# Altium project PSLink.PrjPcb (part 1 of 3)
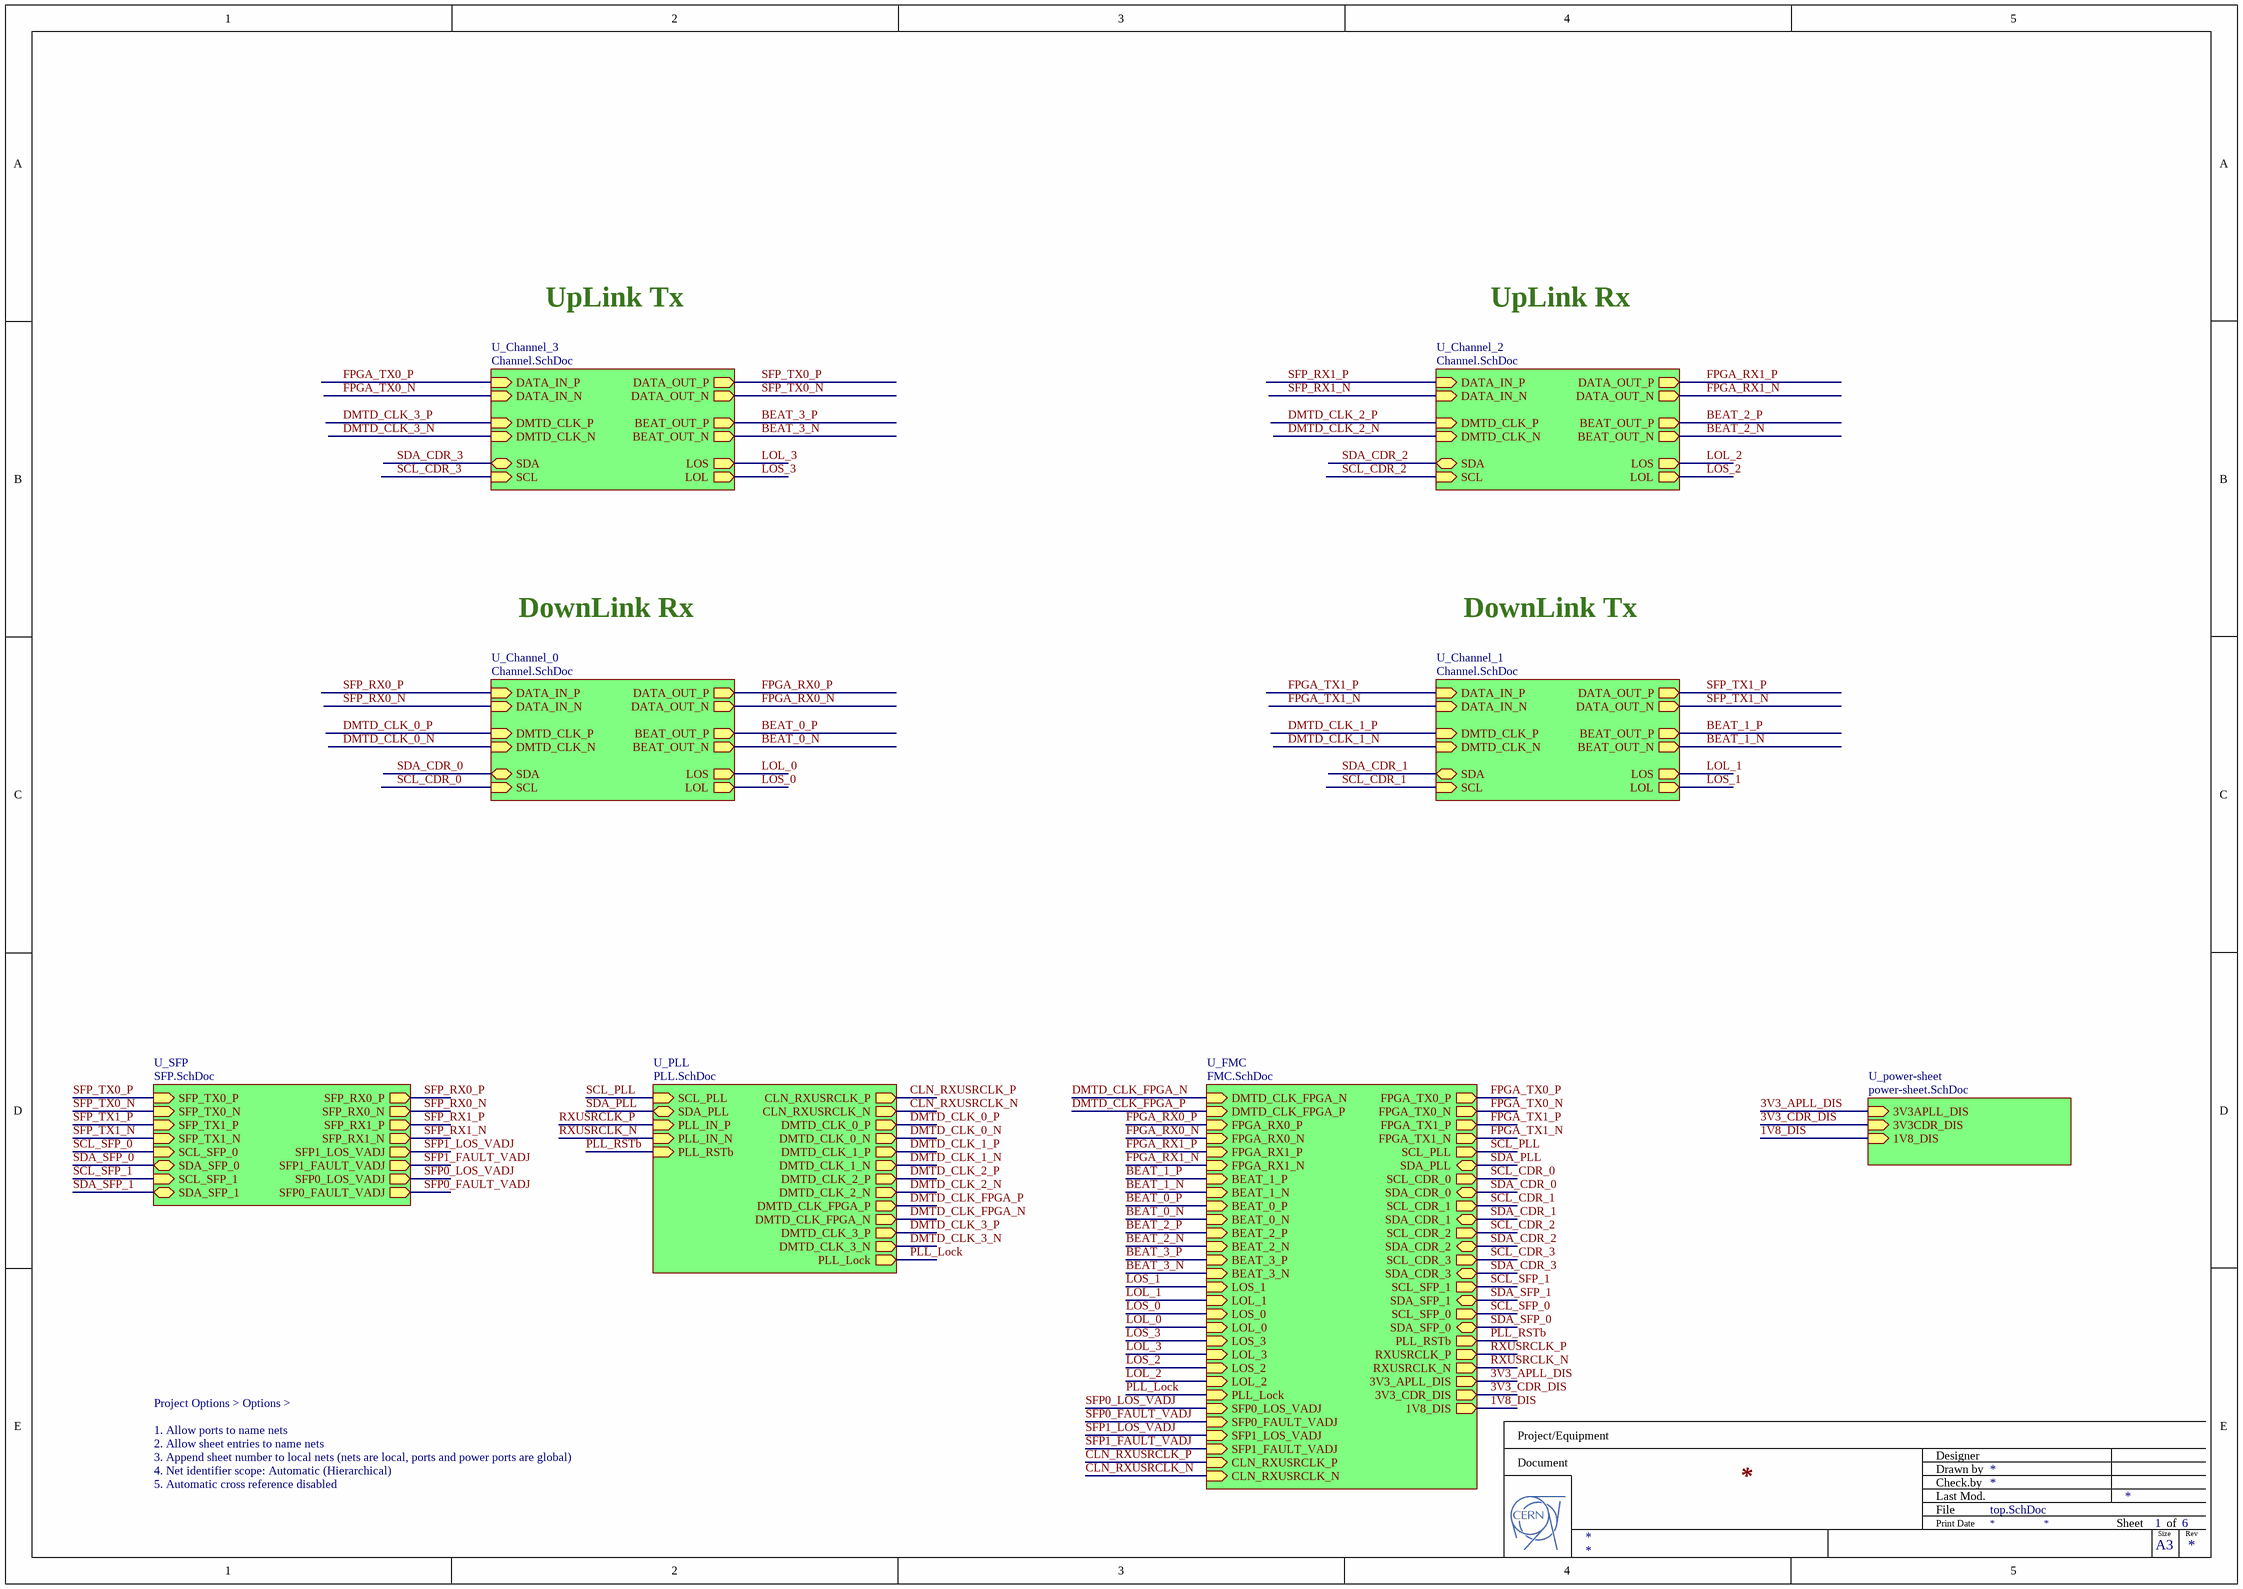
[diagram p0: top.SchDoc]
Board_Revision: 1.0
6 sheets, 435 parts. Net scope: hierarchical (ports join the sheet entries above them; power ports are global).
Board files: PCB.PcbDoc, relaxed_transition.PcbDoc
Sheets:
  top.SchDoc
    U_SFP = SFP.SchDoc
    U_PLL = PLL.SchDoc
    U_Channel_3 = Channel.SchDoc
    U_Channel_2 = Channel.SchDoc
    U_Channel_1 = Channel.SchDoc
    U_Channel_0 = Channel.SchDoc
    U_power-sheet = power-sheet.SchDoc
    U_FMC = FMC.SchDoc

## Sheet top.SchDoc
size 420 x 297 mm; SheetNumber: 1; SheetTotal: 6

### Sub-sheets
U_Channel_0 = Channel.SchDoc: DATA_IN_P (in), DATA_IN_N (in), BEAT_OUT_P (out), BEAT_OUT_N (out), DMTD_CLK_P (in), DMTD_CLK_N (in), DATA_OUT_P (out), DATA_OUT_N (out), LOS (out), LOL (out), SDA (bidir), SCL (in)
U_Channel_1 = Channel.SchDoc: DATA_IN_P (in), DATA_IN_N (in), BEAT_OUT_P (out), BEAT_OUT_N (out), DMTD_CLK_P (in), DMTD_CLK_N (in), DATA_OUT_P (out), DATA_OUT_N (out), LOS (out), LOL (out), SDA (bidir), SCL (in)
U_Channel_2 = Channel.SchDoc: DATA_IN_P (in), DATA_IN_N (in), BEAT_OUT_P (out), BEAT_OUT_N (out), DMTD_CLK_P (in), DMTD_CLK_N (in), DATA_OUT_P (out), DATA_OUT_N (out), LOS (out), LOL (out), SDA (bidir), SCL (in)
U_Channel_3 = Channel.SchDoc: DATA_IN_P (in), DATA_IN_N (in), BEAT_OUT_P (out), BEAT_OUT_N (out), DMTD_CLK_P (in), DMTD_CLK_N (in), DATA_OUT_P (out), DATA_OUT_N (out), LOS (out), LOL (out), SDA (bidir), SCL (in)
U_FMC = FMC.SchDoc: DMTD_CLK_FPGA_N (in), DMTD_CLK_FPGA_P (in), FPGA_RX0_P (in), FPGA_RX0_N (in), FPGA_TX0_P (out), FPGA_TX0_N (out), FPGA_RX1_P (in), FPGA_RX1_N (in), FPGA_TX1_P (out), FPGA_TX1_N (out), BEAT_1_P (in), BEAT_1_N (in), BEAT_0_P (in), BEAT_0_N (in), BEAT_2_P (in), BEAT_2_N (in), BEAT_3_P (in), BEAT_3_N (in), SCL_PLL (out), SDA_PLL (bidir), SCL_CDR_0 (out), SDA_CDR_0 (bidir), SCL_CDR_1 (out), SDA_CDR_1 (bidir), SCL_CDR_2 (out), SDA_CDR_2 (bidir), SCL_CDR_3 (out), SDA_CDR_3 (bidir), SCL_SFP_1 (out), SDA_SFP_1 (bidir), SCL_SFP_0 (out), SDA_SFP_0 (bidir), LOS_1 (in), LOL_1 (in), LOS_0 (in), LOL_0 (in), LOS_3 (in), LOL_3 (in), LOS_2 (in), LOL_2 (in), PLL_Lock (in), SFP0_LOS_VADJ (in), SFP0_FAULT_VADJ (in), SFP1_LOS_VADJ (in), SFP1_FAULT_VADJ (in), PLL_RSTb (out), CLN_RXUSRCLK_P (in), CLN_RXUSRCLK_N (in), RXUSRCLK_P (out), RXUSRCLK_N (out), 3V3_APLL_DIS (out), 3V3_CDR_DIS (out), 1V8_DIS (out)
U_PLL = PLL.SchDoc: SCL_PLL (in), SDA_PLL (bidir), PLL_IN_P (in), PLL_IN_N (in), CLN_RXUSRCLK_P (out), CLN_RXUSRCLK_N (out), DMTD_CLK_0_P (out), DMTD_CLK_0_N (out), DMTD_CLK_1_P (out), DMTD_CLK_1_N (out), DMTD_CLK_2_P (out), DMTD_CLK_2_N (out), DMTD_CLK_FPGA_P (out), DMTD_CLK_FPGA_N (out), DMTD_CLK_3_P (out), DMTD_CLK_3_N (out), PLL_Lock (out), PLL_RSTb (in)
U_power-sheet = power-sheet.SchDoc: 3V3APLL_DIS (in), 3V3CDR_DIS (in), 1V8_DIS (in)
U_SFP = SFP.SchDoc: SFP_RX0_P (out), SFP_RX0_N (out), SFP_TX0_P (in), SFP_TX0_N (in), SFP_RX1_P (out), SFP_RX1_N (out), SFP_TX1_P (in), SFP_TX1_N (in), SCL_SFP_0 (in), SDA_SFP_0 (bidir), SCL_SFP_1 (in), SDA_SFP_1 (bidir), SFP1_LOS_VADJ (out), SFP1_FAULT_VADJ (out), SFP0_LOS_VADJ (out), SFP0_FAULT_VADJ (out)

### Nets
1V8_DIS: sheet U_power-sheet/1V8_DIS, sheet U_FMC/1V8_DIS
3V3_APLL_DIS: sheet U_power-sheet/3V3APLL_DIS, sheet U_FMC/3V3_APLL_DIS
3V3_CDR_DIS: sheet U_power-sheet/3V3CDR_DIS, sheet U_FMC/3V3_CDR_DIS
BEAT_0_N: sheet U_Channel_0/BEAT_OUT_N, sheet U_FMC/BEAT_0_N
BEAT_0_P: sheet U_Channel_0/BEAT_OUT_P, sheet U_FMC/BEAT_0_P
BEAT_1_N: sheet U_Channel_1/BEAT_OUT_N, sheet U_FMC/BEAT_1_N
BEAT_1_P: sheet U_Channel_1/BEAT_OUT_P, sheet U_FMC/BEAT_1_P
BEAT_2_N: sheet U_Channel_2/BEAT_OUT_N, sheet U_FMC/BEAT_2_N
BEAT_2_P: sheet U_Channel_2/BEAT_OUT_P, sheet U_FMC/BEAT_2_P
BEAT_3_N: sheet U_Channel_3/BEAT_OUT_N, sheet U_FMC/BEAT_3_N
BEAT_3_P: sheet U_Channel_3/BEAT_OUT_P, sheet U_FMC/BEAT_3_P
CLN_RXUSRCLK_N: sheet U_PLL/CLN_RXUSRCLK_N, sheet U_FMC/CLN_RXUSRCLK_N
CLN_RXUSRCLK_P: sheet U_PLL/CLN_RXUSRCLK_P, sheet U_FMC/CLN_RXUSRCLK_P
DMTD_CLK_0_N: sheet U_PLL/DMTD_CLK_0_N, sheet U_Channel_0/DMTD_CLK_N
DMTD_CLK_0_P: sheet U_PLL/DMTD_CLK_0_P, sheet U_Channel_0/DMTD_CLK_P
DMTD_CLK_1_N: sheet U_PLL/DMTD_CLK_1_N, sheet U_Channel_1/DMTD_CLK_N
DMTD_CLK_1_P: sheet U_PLL/DMTD_CLK_1_P, sheet U_Channel_1/DMTD_CLK_P
DMTD_CLK_2_N: sheet U_PLL/DMTD_CLK_2_N, sheet U_Channel_2/DMTD_CLK_N
DMTD_CLK_2_P: sheet U_PLL/DMTD_CLK_2_P, sheet U_Channel_2/DMTD_CLK_P
DMTD_CLK_3_N: sheet U_PLL/DMTD_CLK_3_N, sheet U_Channel_3/DMTD_CLK_N
DMTD_CLK_3_P: sheet U_PLL/DMTD_CLK_3_P, sheet U_Channel_3/DMTD_CLK_P
DMTD_CLK_FPGA_N: sheet U_PLL/DMTD_CLK_FPGA_N, sheet U_FMC/DMTD_CLK_FPGA_N
DMTD_CLK_FPGA_P: sheet U_PLL/DMTD_CLK_FPGA_P, sheet U_FMC/DMTD_CLK_FPGA_P
FPGA_RX0_N: sheet U_Channel_0/DATA_OUT_N, sheet U_FMC/FPGA_RX0_N
FPGA_RX0_P: sheet U_Channel_0/DATA_OUT_P, sheet U_FMC/FPGA_RX0_P
FPGA_RX1_N: sheet U_Channel_2/DATA_OUT_N, sheet U_FMC/FPGA_RX1_N
FPGA_RX1_P: sheet U_Channel_2/DATA_OUT_P, sheet U_FMC/FPGA_RX1_P
FPGA_TX0_N: sheet U_Channel_3/DATA_IN_N, sheet U_FMC/FPGA_TX0_N
FPGA_TX0_P: sheet U_Channel_3/DATA_IN_P, sheet U_FMC/FPGA_TX0_P
FPGA_TX1_N: sheet U_Channel_1/DATA_IN_N, sheet U_FMC/FPGA_TX1_N
FPGA_TX1_P: sheet U_Channel_1/DATA_IN_P, sheet U_FMC/FPGA_TX1_P
LOL_0: sheet U_Channel_0/LOS, sheet U_FMC/LOL_0
LOL_1: sheet U_Channel_1/LOS, sheet U_FMC/LOL_1
LOL_2: sheet U_Channel_2/LOS, sheet U_FMC/LOL_2
LOL_3: sheet U_Channel_3/LOS, sheet U_FMC/LOL_3
LOS_0: sheet U_Channel_0/LOL, sheet U_FMC/LOS_0  [project net LOL]
LOS_1: sheet U_Channel_1/LOL, sheet U_FMC/LOS_1  [project net LOL]
LOS_2: sheet U_Channel_2/LOL, sheet U_FMC/LOS_2  [project net LOL]
LOS_3: sheet U_Channel_3/LOL, sheet U_FMC/LOS_3  [project net LOL]
PLL_Lock: sheet U_PLL/PLL_Lock, sheet U_FMC/PLL_Lock  [project net Lock]
PLL_RSTb: sheet U_PLL/PLL_RSTb, sheet U_FMC/PLL_RSTb
RXUSRCLK_N: sheet U_PLL/PLL_IN_N, sheet U_FMC/RXUSRCLK_N
RXUSRCLK_P: sheet U_PLL/PLL_IN_P, sheet U_FMC/RXUSRCLK_P
SCL_CDR_0: sheet U_Channel_0/SCL, sheet U_FMC/SCL_CDR_0  [project net SCL_5]
SCL_CDR_1: sheet U_Channel_1/SCL, sheet U_FMC/SCL_CDR_1  [project net SCL_4]
SCL_CDR_2: sheet U_Channel_2/SCL, sheet U_FMC/SCL_CDR_2  [project net SCL_3]
SCL_CDR_3: sheet U_Channel_3/SCL, sheet U_FMC/SCL_CDR_3  [project net SCL_2]
SCL_PLL: sheet U_PLL/SCL_PLL, sheet U_FMC/SCL_PLL  [project net ADJ_SCL]
SCL_SFP_0: sheet U_SFP/SCL_SFP_0, sheet U_FMC/SCL_SFP_0  [project net SCL0]
SCL_SFP_1: sheet U_SFP/SCL_SFP_1, sheet U_FMC/SCL_SFP_1  [project net SCL1]
SDA_CDR_0: sheet U_Channel_0/SDA, sheet U_FMC/SDA_CDR_0  [project net SDA_5]
SDA_CDR_1: sheet U_Channel_1/SDA, sheet U_FMC/SDA_CDR_1  [project net SDA_4]
SDA_CDR_2: sheet U_Channel_2/SDA, sheet U_FMC/SDA_CDR_2  [project net SDA_3]
SDA_CDR_3: sheet U_Channel_3/SDA, sheet U_FMC/SDA_CDR_3  [project net SDA_2]
SDA_PLL: sheet U_PLL/SDA_PLL, sheet U_FMC/SDA_PLL  [project net ADJ_SDA]
SDA_SFP_0: sheet U_SFP/SDA_SFP_0, sheet U_FMC/SDA_SFP_0  [project net SDA0]
SDA_SFP_1: sheet U_SFP/SDA_SFP_1, sheet U_FMC/SDA_SFP_1  [project net SDA1]
SFP0_FAULT_VADJ: sheet U_SFP/SFP0_FAULT_VADJ, sheet U_FMC/SFP0_FAULT_VADJ
SFP0_LOS_VADJ: sheet U_SFP/SFP0_LOS_VADJ, sheet U_FMC/SFP0_LOS_VADJ
SFP1_FAULT_VADJ: sheet U_SFP/SFP1_FAULT_VADJ, sheet U_FMC/SFP1_FAULT_VADJ
SFP1_LOS_VADJ: sheet U_SFP/SFP1_LOS_VADJ, sheet U_FMC/SFP1_LOS_VADJ
SFP_RX0_N: sheet U_SFP/SFP_RX0_N, sheet U_Channel_0/DATA_IN_N
SFP_RX0_P: sheet U_SFP/SFP_RX0_P, sheet U_Channel_0/DATA_IN_P
SFP_RX1_N: sheet U_SFP/SFP_RX1_N, sheet U_Channel_2/DATA_IN_N
SFP_RX1_P: sheet U_SFP/SFP_RX1_P, sheet U_Channel_2/DATA_IN_P
SFP_TX0_N: sheet U_SFP/SFP_TX0_N, sheet U_Channel_3/DATA_OUT_N
SFP_TX0_P: sheet U_SFP/SFP_TX0_P, sheet U_Channel_3/DATA_OUT_P
SFP_TX1_N: sheet U_SFP/SFP_TX1_N, sheet U_Channel_1/DATA_OUT_N
SFP_TX1_P: sheet U_SFP/SFP_TX1_P, sheet U_Channel_1/DATA_OUT_P

### Notes on the sheet
- UpLink Tx
- UpLink Rx
- DownLink Rx
- DownLink Tx
- Project Options > Options >
  1. Allow ports to name nets
  2. Allow sheet entries to name nets
  3. Append sheet number to local nets (nets are local, ports and power ports are global)
  4. Net identifier scope: Automatic (Hierarchical)
  5. Automatic cross reference disabled
- Project/Equipment
- Document
- Designer
- Drawn by
- Check.by
- File
- Last Mod.
- Print Date
- Sheet
- Size
- A3
- of
- Rev

## Sheet SFP.SchDoc
size 420 x 297 mm; SheetNumber: 2; SheetTotal: 6
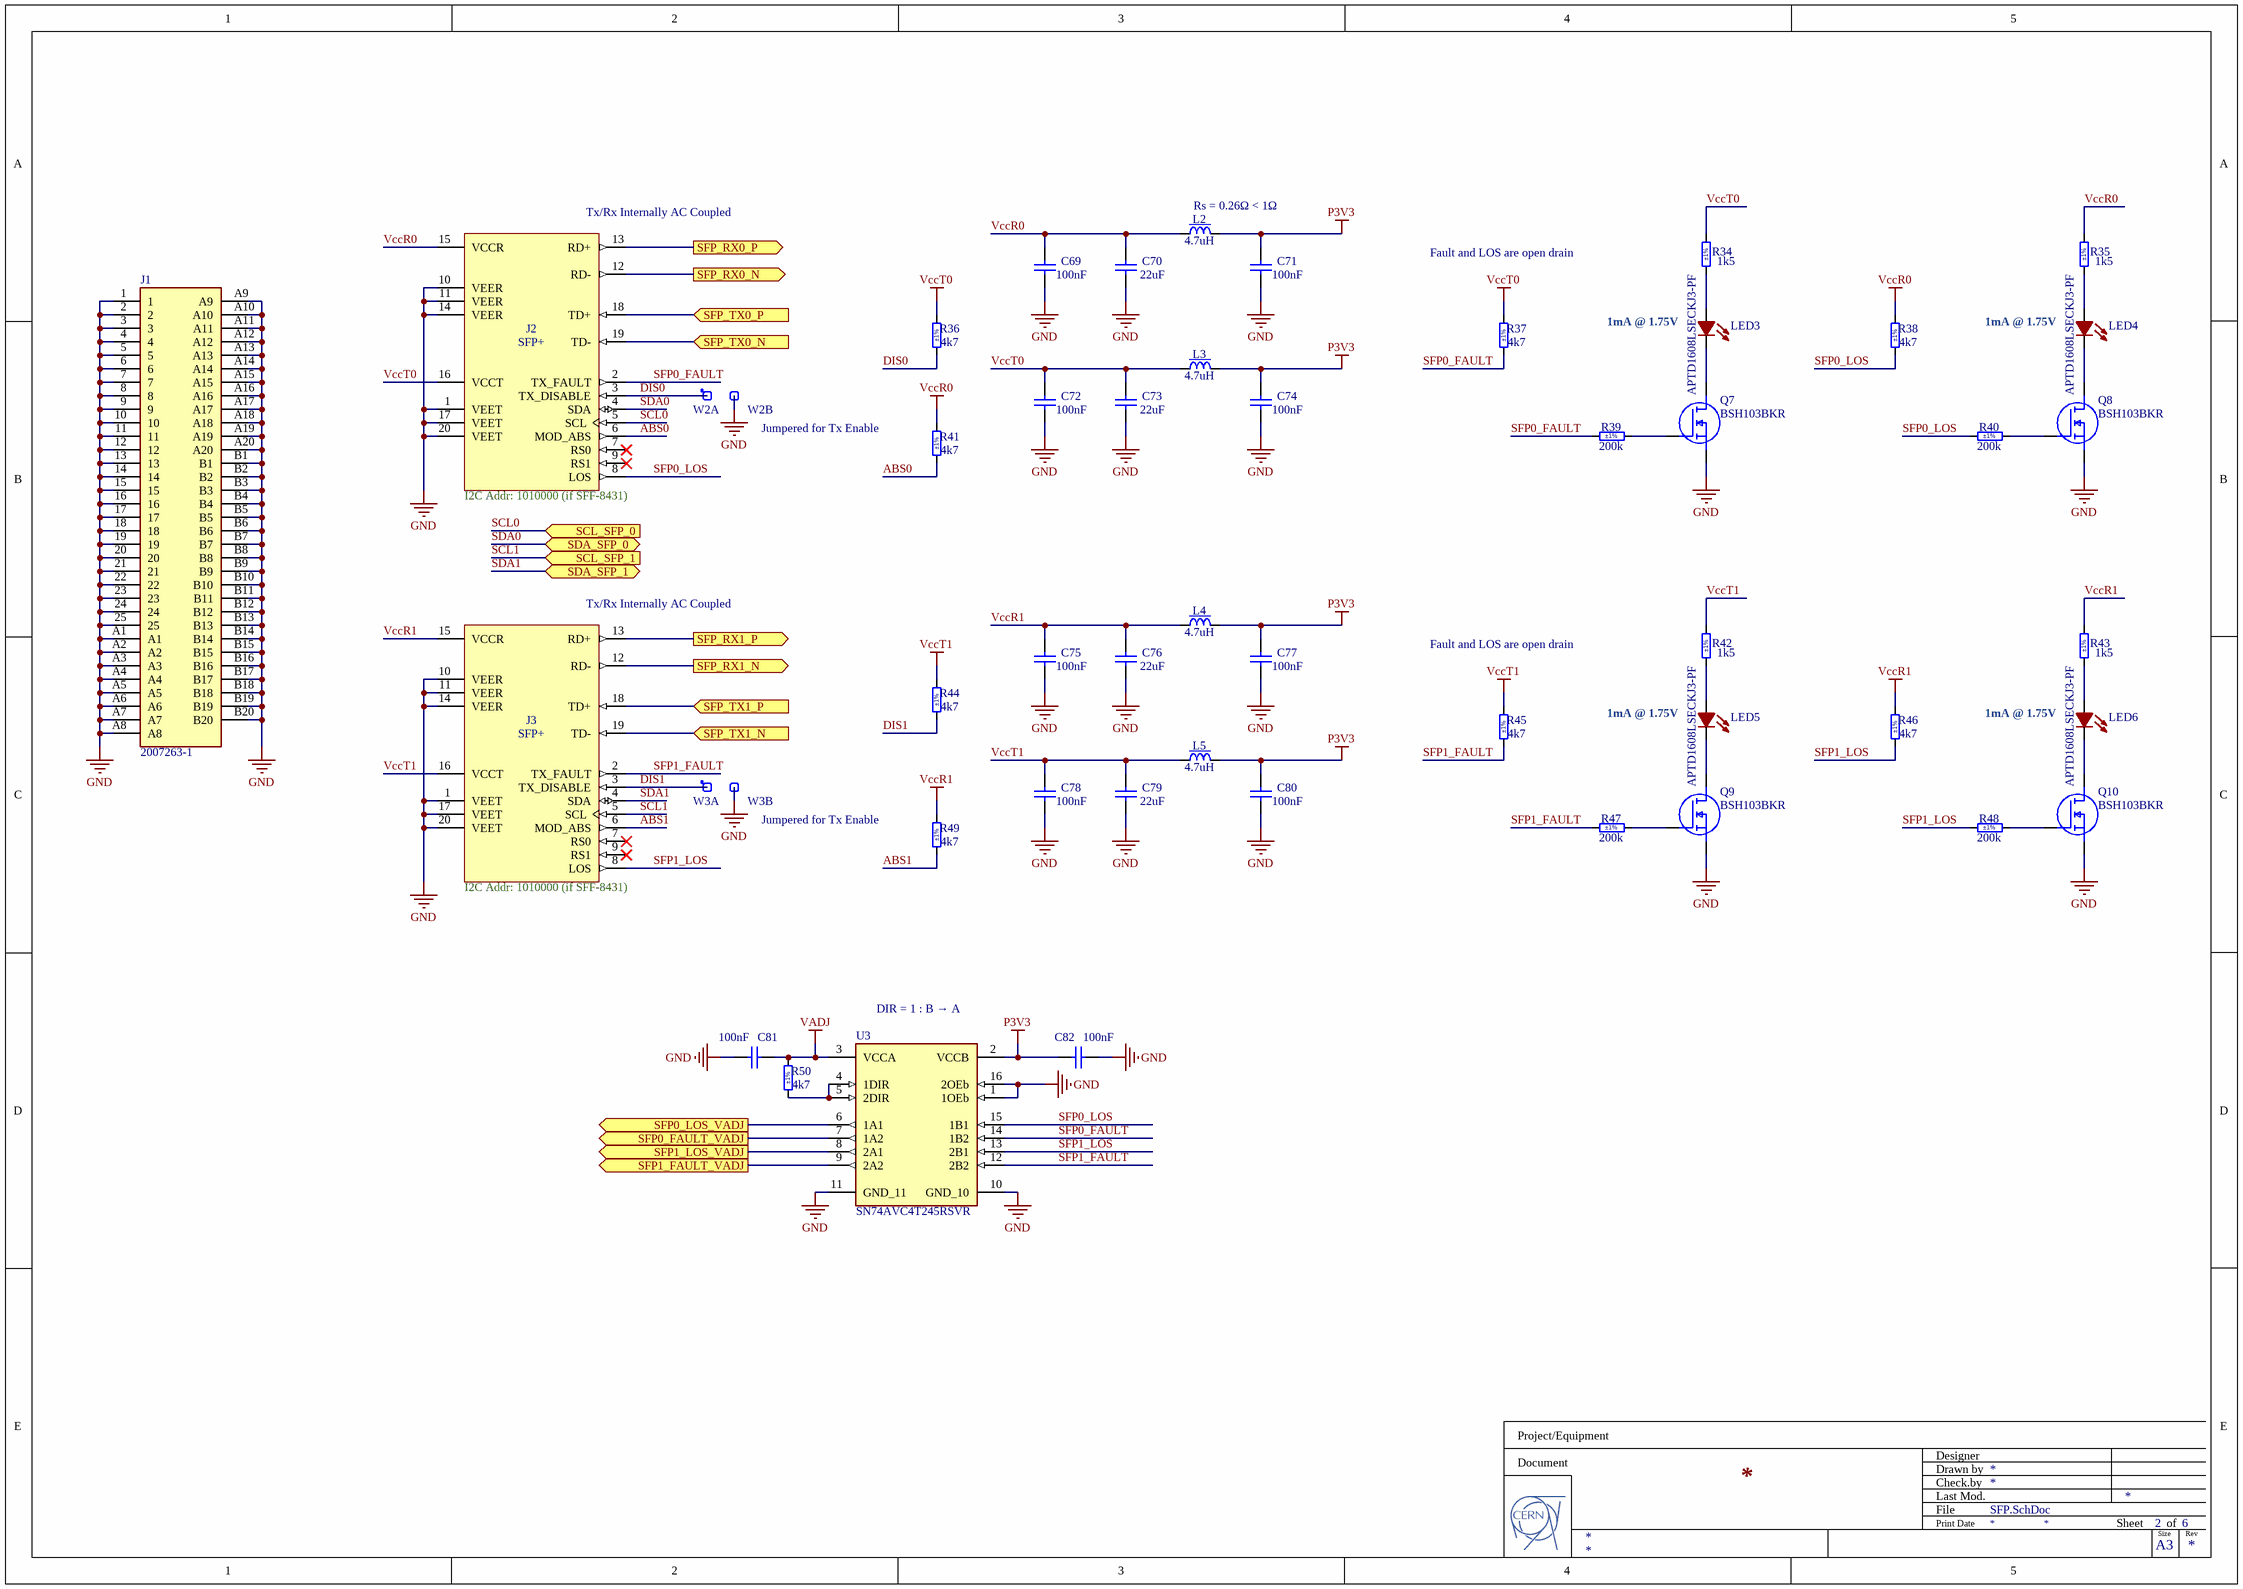
[diagram p1: SFP.SchDoc]

### Parts
C69  100nF  [CAPC0603X33N]
C70  22uF  [CAPC1005X70N]
C71  100nF  [CAPC0603X33N]
C72  100nF  [CAPC0603X33N]
C73  22uF  [CAPC1005X70N]
C74  100nF  [CAPC0603X33N]
C75  100nF  [CAPC0603X33N]
C76  22uF  [CAPC1005X70N]
C77  100nF  [CAPC0603X33N]
C78  100nF  [CAPC0603X33N]
C79  22uF  [CAPC1005X70N]
C80  100nF  [CAPC0603X33N]
C81  100nF  [CAPC0603X33N]
C82  100nF  [CAPC0603X33N]
J1  2007263-1  [20072631]
J2  SFP+  [TYCO_1888247-1]
J3  SFP+  [TYCO_1888247-1]
L2  4.7uH  [IND_MURATA_LQH32C]
L3  4.7uH  [IND_MURATA_LQH32C]
L4  4.7uH  [IND_MURATA_LQH32C]
L5  4.7uH  [IND_MURATA_LQH32C]
LED3  APTD1608LSECKJ3-PF  [LED_APTD1608LSECKJ3-PF_KNB]
LED4  APTD1608LSECKJ3-PF  [LED_APTD1608LSECKJ3-PF_KNB]
LED5  APTD1608LSECKJ3-PF  [LED_APTD1608LSECKJ3-PF_KNB]
LED6  APTD1608LSECKJ3-PF  [LED_APTD1608LSECKJ3-PF_KNB]
Q7  BSH103BKR  [SOT95P230X110-3N]
Q8  BSH103BKR  [SOT95P230X110-3N]
Q9  BSH103BKR  [SOT95P230X110-3N]
Q10  BSH103BKR  [SOT95P230X110-3N]
R34  1k5  Tolerance: ±1%  [RESC1005X40N]
R35  1k5  Tolerance: ±1%  [RESC1005X40N]
R36  4k7  Tolerance: ±1%  [RESC1005X40N]
R37  4k7  Tolerance: ±1%  [RESC1005X40N]
R38  4k7  Tolerance: ±1%  [RESC1005X40N]
R39  200k  Tolerance: ±1%  [RESC1005X40N]
R40  200k  Tolerance: ±1%  [RESC1005X40N]
R41  4k7  Tolerance: ±1%  [RESC1005X40N]
R42  1k5  Tolerance: ±1%  [RESC1005X40N]
R43  1k5  Tolerance: ±1%  [RESC1005X40N]
R44  4k7  Tolerance: ±1%  [RESC1005X40N]
R45  4k7  Tolerance: ±1%  [RESC1005X40N]
R46  4k7  Tolerance: ±1%  [RESC1005X40N]
R47  200k  Tolerance: ±1%  [RESC1005X40N]
R48  200k  Tolerance: ±1%  [RESC1005X40N]
R49  4k7  Tolerance: ±1%  [RESC1005X40N]
R50  4k7  Tolerance: ±1%  [RESC1005X40N]
U3  SN74AVC4T245RSVR  [QFN40P260X180X55-16N]
W2  Header 2  [SAMTEC_HTSW-102-23-L-S]  (value not drawn)  (parts A,B of 2)
W3  Header 2  [SAMTEC_HTSW-102-23-L-S]  (value not drawn)  (parts A,B of 2)

### Ports
SCL_SFP_0 (in), SCL_SFP_1 (in), SDA_SFP_0 (bidir), SDA_SFP_1 (bidir), SFP0_FAULT_VADJ (out), SFP0_LOS_VADJ (out), SFP1_FAULT_VADJ (out), SFP1_LOS_VADJ (out), SFP_RX0_N (out), SFP_RX0_P (out), SFP_RX1_N (out), SFP_RX1_P (out), SFP_TX0_N (in), SFP_TX0_P (in), SFP_TX1_N (in), SFP_TX1_P (in)

### Nets
GND: C69.1 C70.1 C71.1 C72.1 C73.1 C74.1 C75.1 C76.1 C77.1 C78.1 C79.1 C80.1 C81.1 C82.1 J1.1 J1.2 J1.3 J1.4 J1.5 J1.6 J1.7 J1.8 J1.9 J1.10 J1.11 J1.12 J1.13 J1.14 J1.15 J1.16 J1.17 J1.18 J1.19 J1.20 J1.21 J1.22 J1.23 J1.24 J1.25 J1.A1 J1.A2 J1.A3 J1.A4 J1.A5 J1.A6 J1.A7 J1.A8 J1.A9 J1.A10 J1.A11 J1.A12 J1.A13 J1.A14 J1.A15 J1.A16 J1.A17 J1.A18 J1.A19 J1.A20 J1.B1 J1.B2 J1.B3 J1.B4 J1.B5 J1.B6 J1.B7 J1.B8 J1.B9 J1.B10 J1.B11 J1.B12 J1.B13 J1.B14 J1.B15 J1.B16 J1.B17 J1.B18 J1.B19 J1.B20 J2.1(VEET) J2.10(VEER) J2.11(VEER) J2.14(VEER) J2.17(VEET) J2.20(VEET) J3.1(VEET) J3.10(VEER) J3.11(VEER) J3.14(VEER) J3.17(VEET) J3.20(VEET) Q7.2(S) Q8.2(S) Q9.2(S) Q10.2(S) U3.1(1OEb) U3.10(GND_10) U3.11(GND_11) U3.16(2OEb) W2.2 W3.2
P3V3: C71.2 C74.2 C77.2 C80.2 C82.2 L2.2 L3.2 L4.2 L5.2 U3.2(VCCB)
VADJ: C81.2 R50.2 U3.3(VCCA)
VccR0: C69.2 C70.2 J2.15(VCCR) L2.1 R35.2 R38.2 R41.2
VccR1: C75.2 C76.2 J3.15(VCCR) L4.1 R43.2 R46.2 R49.2
VccT0: C72.2 C73.2 J2.16(VCCT) L3.1 R34.2 R36.2 R37.2
VccT1: C78.2 C79.2 J3.16(VCCT) L5.1 R42.2 R44.2 R45.2
ABS0: J2.6(MOD_ABS) R41.1
ABS1: J3.6(MOD_ABS) R49.1
DIS0: J2.3(TX_DISABLE) R36.1 W2.1
DIS1: J3.3(TX_DISABLE) R44.1 W3.1
SCL0: J2.5(SCL) ; port SCL_SFP_0
SCL1: J3.5(SCL) ; port SCL_SFP_1
SDA0: J2.4(SDA) ; port SDA_SFP_0
SDA1: J3.4(SDA) ; port SDA_SFP_1
SFP0_FAULT: J2.2(TX_FAULT) R37.1 R39.1 U3.14(1B2)
SFP0_FAULT_VADJ: U3.7(1A2) ; port SFP0_FAULT_VADJ
SFP0_LOS: J2.8(LOS) R38.1 R40.1 U3.15(1B1)
SFP0_LOS_VADJ: U3.6(1A1) ; port SFP0_LOS_VADJ
SFP1_FAULT: J3.2(TX_FAULT) R45.1 R47.1 U3.12(2B2)
SFP1_FAULT_VADJ: U3.9(2A2) ; port SFP1_FAULT_VADJ
SFP1_LOS: J3.8(LOS) R46.1 R48.1 U3.13(2B1)
SFP1_LOS_VADJ: U3.8(2A1) ; port SFP1_LOS_VADJ
SFP_RX0_N: J2.12(RD-) ; port SFP_RX0_N
SFP_RX0_P: J2.13(RD+) ; port SFP_RX0_P
SFP_RX1_N: J3.12(RD-) ; port SFP_RX1_N
SFP_RX1_P: J3.13(RD+) ; port SFP_RX1_P
SFP_TX0_N: J2.19(TD-) ; port SFP_TX0_N
SFP_TX0_P: J2.18(TD+) ; port SFP_TX0_P
SFP_TX1_N: J3.19(TD-) ; port SFP_TX1_N
SFP_TX1_P: J3.18(TD+) ; port SFP_TX1_P
NetLED3_1: LED3.1(C) Q7.3(D)
NetLED3_2: LED3.2(A) R34.1
NetLED4_1: LED4.1(C) Q8.3(D)
NetLED4_2: LED4.2(A) R35.1
NetLED5_1: LED5.1(C) Q9.3(D)
NetLED5_2: LED5.2(A) R42.1
NetLED6_1: LED6.1(C) Q10.3(D)
NetLED6_2: LED6.2(A) R43.1
NetQ7_1: Q7.1(G) R39.2
NetQ8_1: Q8.1(G) R40.2
NetQ9_1: Q9.1(G) R47.2
NetQ10_1: Q10.1(G) R48.2
NetR50_1: R50.1 U3.4(1DIR) U3.5(2DIR)

Not connected (* = marked no-connect by the designer): J2 7(RS0)* 9(RS1)*; J3 7(RS0)* 9(RS1)*

### Notes on the sheet
- (near J2) Tx/Rx Internally AC Coupled
- (near L2) Rs = 0.26Ω < 1Ω
- Fault and LOS are open drain
- (near LED3) 1mA @ 1.75V
- (near LED4) 1mA @ 1.75V
- Jumpered for Tx Enable
- (near J2) I2C Addr: 1010000 (if SFF-8431)
- (near J3) Tx/Rx Internally AC Coupled
- (near LED5) 1mA @ 1.75V
- (near LED6) 1mA @ 1.75V
- (near J3) I2C Addr: 1010000 (if SFF-8431)
- (near U3) DIR = 1 : B → A
- Project/Equipment
- Document
- Designer
- Drawn by
- Check.by
- File
- Last Mod.
- Print Date
- Sheet
- Size
- A3
- of
- Rev

### Library data of the parts
C69 C71 C72 C74 C75 C77 C78 C80 = CC0201_100NF_6.3V_10%_X7R: Non-polarised capacitor; Part Description: SMD Multilayer Chip Ceramic Capacitor; Manufacturer: GENERIC; Manufacturer1 Part Number: CC0201KRX7R5BB104; Voltage: 6.3V; TC: X7R; Tolerance: ±10%; Part Number: CC0201_100NF_6.3V_10%_X7R; Component Kind: Standard; Component Type: Standard; Pin Count: 2; Value: 100nF; Status: Not Recommended; Manufacturer Part Number: CC0201_100NF_6.3V_10%_X7R; Case: 0201; Mounted: Yes; Socket: No; SMD: Yes; Sense: No; Manufacturer1 Example: YAGEO PHYCOMP; Manufacturer1 ComponentHeight: 0.33mm; HelpURL: \\cern.ch\dfs\Applications\Altium\Datasheets\CC0201_X7R_YAGEO_6.3VTO50V.pdf; Author: CERN DEM BC; CreateDate: 11/20/2020; LatestRevisionDate: 11/20/2020
C70 C73 C76 C79 = CC0402_10UF_6.3V_20%_X5R: GRM155R60J226ME11; Part Description: SMD Multilayer Chip Ceramic Capacitor; Manufacturer: GENERIC; Manufacturer1 Part Number: C1005X5R0J106M050; Value: 10uF; Voltage: 6.3V; TC: X5R; Tolerance: ±10%; Part Number: CC0402_10UF_6.3V_20%_X5R; Component Kind: Standard; Component Type: Standard; Pin Count: 2; Status: Preferred; Manufacturer Part Number: CC0402_10UF_6.3V_20%_X5R; Case: 0402; Mounted: Yes; Socket: No; SMD: Yes; Sense: No; Manufacturer1 Example: TDK; Manufacturer1 ComponentHeight: 0.70mm; HelpURL: \\cern.ch\dfs\Applications\Altium\Datasheets\CC0402_X5R_TDK_C.pdf; Author: CERN DEM JLC; CreateDate: 1/7/2015; LatestRevisionDate: 1/7/2015
C81 C82 = CC0201_100NF_6.3V_10%_X5R: GRM033R61C104KE14; Part Description: SMD Multilayer Chip Ceramic Capacitor; Manufacturer: GENERIC; Manufacturer1 Part Number: 02016D104KAT2A; Voltage: 6.3V; TC: X5R; Tolerance: ±10%; Part Number: CC0201_100NF_6.3V_10%_X5R; Component Kind: Standard; Component Type: Standard; Pin Count: 2; Value: 100nF; Status: Not Recommended; Manufacturer Part Number: CC0201_100NF_6.3V_10%_X5R; Case: 0201; Mounted: Yes; Socket: No; SMD: Yes; Sense: No; Manufacturer1 Example: AVX; Manufacturer1 ComponentHeight: 0.33mm; HelpURL: \\cern.ch\dfs\Applications\Altium\Datasheets\CC0201_X5R_AVX.pdf; Author: CERN DEM JLC; CreateDate: 12/3/2007; LatestRevisionDate: 12/3/2007
J1 = 2007263-1: Connector; Manufacturer_Name: TE Connectivity; Datasheet Link: https://www.te.com/commerce/DocumentDelivery/DDEController?Action=srchrtrv&DocNm=4-1773455-3_Quick_Ref_Guide_SFP%2B_Sol&DocType=Data%20Sheet&DocLang=English&PartCntxt=2007263-1&DocFormat=pdf; Height: 9.8mm; Manufacturer_Part_Number: 2007263-1; Mouser Part Number: 571-2007263-1; Mouser Price/Stock: https://www.mouser.co.uk/ProductDetail/TE-Connectivity/2007263-1?qs=4zF2lffhceF8GItBX4M8mw%3D%3D; Arrow Part Number: 2007263-1; Arrow Price/Stock: https://www.arrow.com/en/products/2007263-1/te-connectivity?region=europe
J2 J3 = TYCO_1888247-1: 20 Position SFP+ Connector (Small Form-factor Pluggable); Part Description: 20 Position, Pitch 0.8mm SFP+ Receptacle (Small Form-factor Pluggable); Manufacturer: TYCO ELECTRONICS; PressFit: No; Part Number: TYCO_1888247-1; Component Kind: Standard; Component Type: Standard; Pin Count: 20; Family: SFP+; Mounted: Yes; Socket: No; SMD: Yes; Sense: No; Status: None; Manufacturer Part Number: 1888247-1; ComponentHeight: 5.4mm; HelpURL: \\cern.ch\dfs\Applications\Altium\Datasheets\TYCO_1888247-1.pdf; Author: CERN DEM JLC; CreateDate: 2/27/2012; LatestRevisionDate: 2/27/2012
L2-L5 = IND_4.7UH_20%_MURATA_LQH32CN4R7M23L: Inductor With Core. Rs = 0.26Ω < 1Ω; Part Description: Chip Inductor (Chip Coil) for Choke Wire Wound Type; Manufacturer: MURATA; Power: 450mA; Resistance: 0.2R; Tolerance: ±20%; Part Number: IND_4.7UH_20%_MURATA_LQH32CN4R7M23L; Component Kind: Standard; Component Type: Standard; Pin Count: 2; Value: 4.7uH; Manufacturer Part Number: LQH32CN4R7M23; Mounted: Yes; Socket: No; SMD: Yes; Sense: No; ComponentHeight: 2.2mm; HelpURL: \\cern.ch\dfs\Applications\Altium\Datasheets\IND_MURATA_LQH32CN_23.pdf; Author: CERN DEM JLC; CreateDate: 4/20/2010; LatestRevisionDate: 7/4/2018
LED3-LED6 = APTD1608LSECKJ3-PF: Led Red 0603 2mA 1.8V 50mcd 84mW; Mfr_Name: Kingbright
Q7-Q10 = BSH103BKR: MOSFET (N-Channel); Manufacturer_Name: Nexperia; Datasheet Link: https://ms.componentsearchengine.com/Datasheets/2/BSH103BKR.pdf; Height: 1.1mm; Manufacturer_Part_Number: BSH103BKR; Mouser Part Number: 771-BSH103BKR; Mouser Price/Stock: https://www.mouser.co.uk/ProductDetail/Nexperia/BSH103BKR?qs=GCAb4wyKXLKD%2FWt2ta8c7Q%3D%3D; Arrow Part Number: BSH103BKR; Arrow Price/Stock: https://www.arrow.com/en/products/bsh103bkr/nexperia?region=europe
R34 R35 R42 R43 = R0402_1K5_1%_0.0625W_100PPM: Resistor - 1%; Part Description: General Purpose Thick Film Chip Resistor; Manufacturer: GENERIC; Manufacturer1 Part Number: 232270671502L; TC: ±100ppm/°C; PressFit: No; Part Number: R0402_1K5_1%_0.0625W_100PPM; Component Kind: Standard; Component Type: Standard; Pin Count: 2; Value: 1k5; Status: Not Recommended; Power: 0.0625W; Manufacturer Part Number: R0402_1K5_1%_0.0625W_100PPM; Case: 0402; Mounted: Yes; Sense: No; Socket: No; SMD: Yes; Manufacturer1 Example: YAGEO PHYCOMP; Manufacturer1 ComponentHeight: 0.4mm; HelpURL: \\cern.ch\dfs\Applications\Altium\Datasheets\R0402_Phycomp_RC0402.pdf; Author: CERN DEM JLC; CreateDate: 12/3/2007; LatestRevisionDate: 10/17/2012
R36-R38 R41 R44-R46 R49 R50 = R0402_4K7_1%_0.0625W_100PPM: Resistor - 1%; Part Description: General Purpose Thick Film Chip Resistor; Manufacturer: GENERIC; Manufacturer1 Part Number: 232270674702L; TC: ±100ppm/°C; PressFit: No; Part Number: R0402_4K7_1%_0.0625W_100PPM; Component Kind: Standard; Component Type: Standard; Pin Count: 2; Value: 4k7; Status: Not Recommended; Power: 0.0625W; Manufacturer Part Number: R0402_4K7_1%_0.0625W_100PPM; Case: 0402; Mounted: Yes; Sense: No; Socket: No; SMD: Yes; Manufacturer1 Example: YAGEO PHYCOMP; Manufacturer1 ComponentHeight: 0.4mm; HelpURL: \\cern.ch\dfs\Applications\Altium\Datasheets\R0402_Phycomp_RC0402.pdf; Author: CERN DEM JLC; CreateDate: 12/3/2007; LatestRevisionDate: 10/17/2012
R39 R40 R47 R48 = R0402_200K_1%_0.0625W_100PPM: Resistor - 1%; Part Description: General Purpose Thick Film Chip Resistor; Manufacturer: GENERIC; Manufacturer1 Part Number: 232270672004L; TC: ±100ppm/°C; PressFit: No; Part Number: R0402_200K_1%_0.0625W_100PPM; Component Kind: Standard; Component Type: Standard; Pin Count: 2; Value: 200k; Status: Not Recommended; Power: 0.0625W; Manufacturer Part Number: R0402_200K_1%_0.0625W_100PPM; Case: 0402; Mounted: Yes; Sense: No; Socket: No; SMD: Yes; Manufacturer1 Example: YAGEO PHYCOMP; Manufacturer1 ComponentHeight: 0.4mm; HelpURL: \\cern.ch\dfs\Applications\Altium\Datasheets\R0402_Phycomp_RC0402.pdf; Author: CERN DEM JLC; CreateDate: 12/3/2007; LatestRevisionDate: 10/17/2012
U3 = SN74AVC4T245RSVR: 4-Bit Dual-Supply Bus Transceiver with Configurable Voltage-Level Shifting and 3-State Outputs 16-UQFN -40 to 85; MF: Texas Instruments; Purchase-URL: https://pricing.snapeda.com/search/part/SN74AVC4T245RSVR/?ref=eda; Price: None; SnapEDA_Link: https://www.snapeda.com/parts/SN74AVC4T245RSVR/Texas%20Instruments/view-part/553822/?ref=snap; Package: UQFN-16 Texas Instruments; Availability: Good; Value: *; MP: SN74AVC4T245RSVR
W2 W3 = SAMTEC_HTSW-102-23-L-S: 2 Mini Wire-Wrap Contact Strip Header; Part Description: 2 Contacts, Pitch 2.54mm, Single Row  Through Mount Straight Header (Post Lead 5.84mm, Tail Lead 2.92mm, Insulator 2.54mm); Manufacturer: SAMTEC; PressFit: No; Status Comment: High Temperature; Part Number: SAMTEC_HTSW-102-23-L-S; Component Kind: Standard; Component Type: Standard; Pin Count: 2; Family: Header 2; Mounted: Yes; Socket: No; SMD: No; Sense: No; Status: Preferred; Manufacturer Part Number: HTSW-102-23-L-S; ComponentHeight: 8.38mm; HelpURL: \\cern.ch\dfs\Applications\Altium\Datasheets\SAMTEC_HTSW-102-23-L-S.pdf; Author: CERN DEM JLC; CreateDate: 2/22/2018; LatestRevisionDate: 2/22/2018

## Sheet PLL.SchDoc
size 420 x 297 mm; SheetNumber: 4; SheetTotal: 6
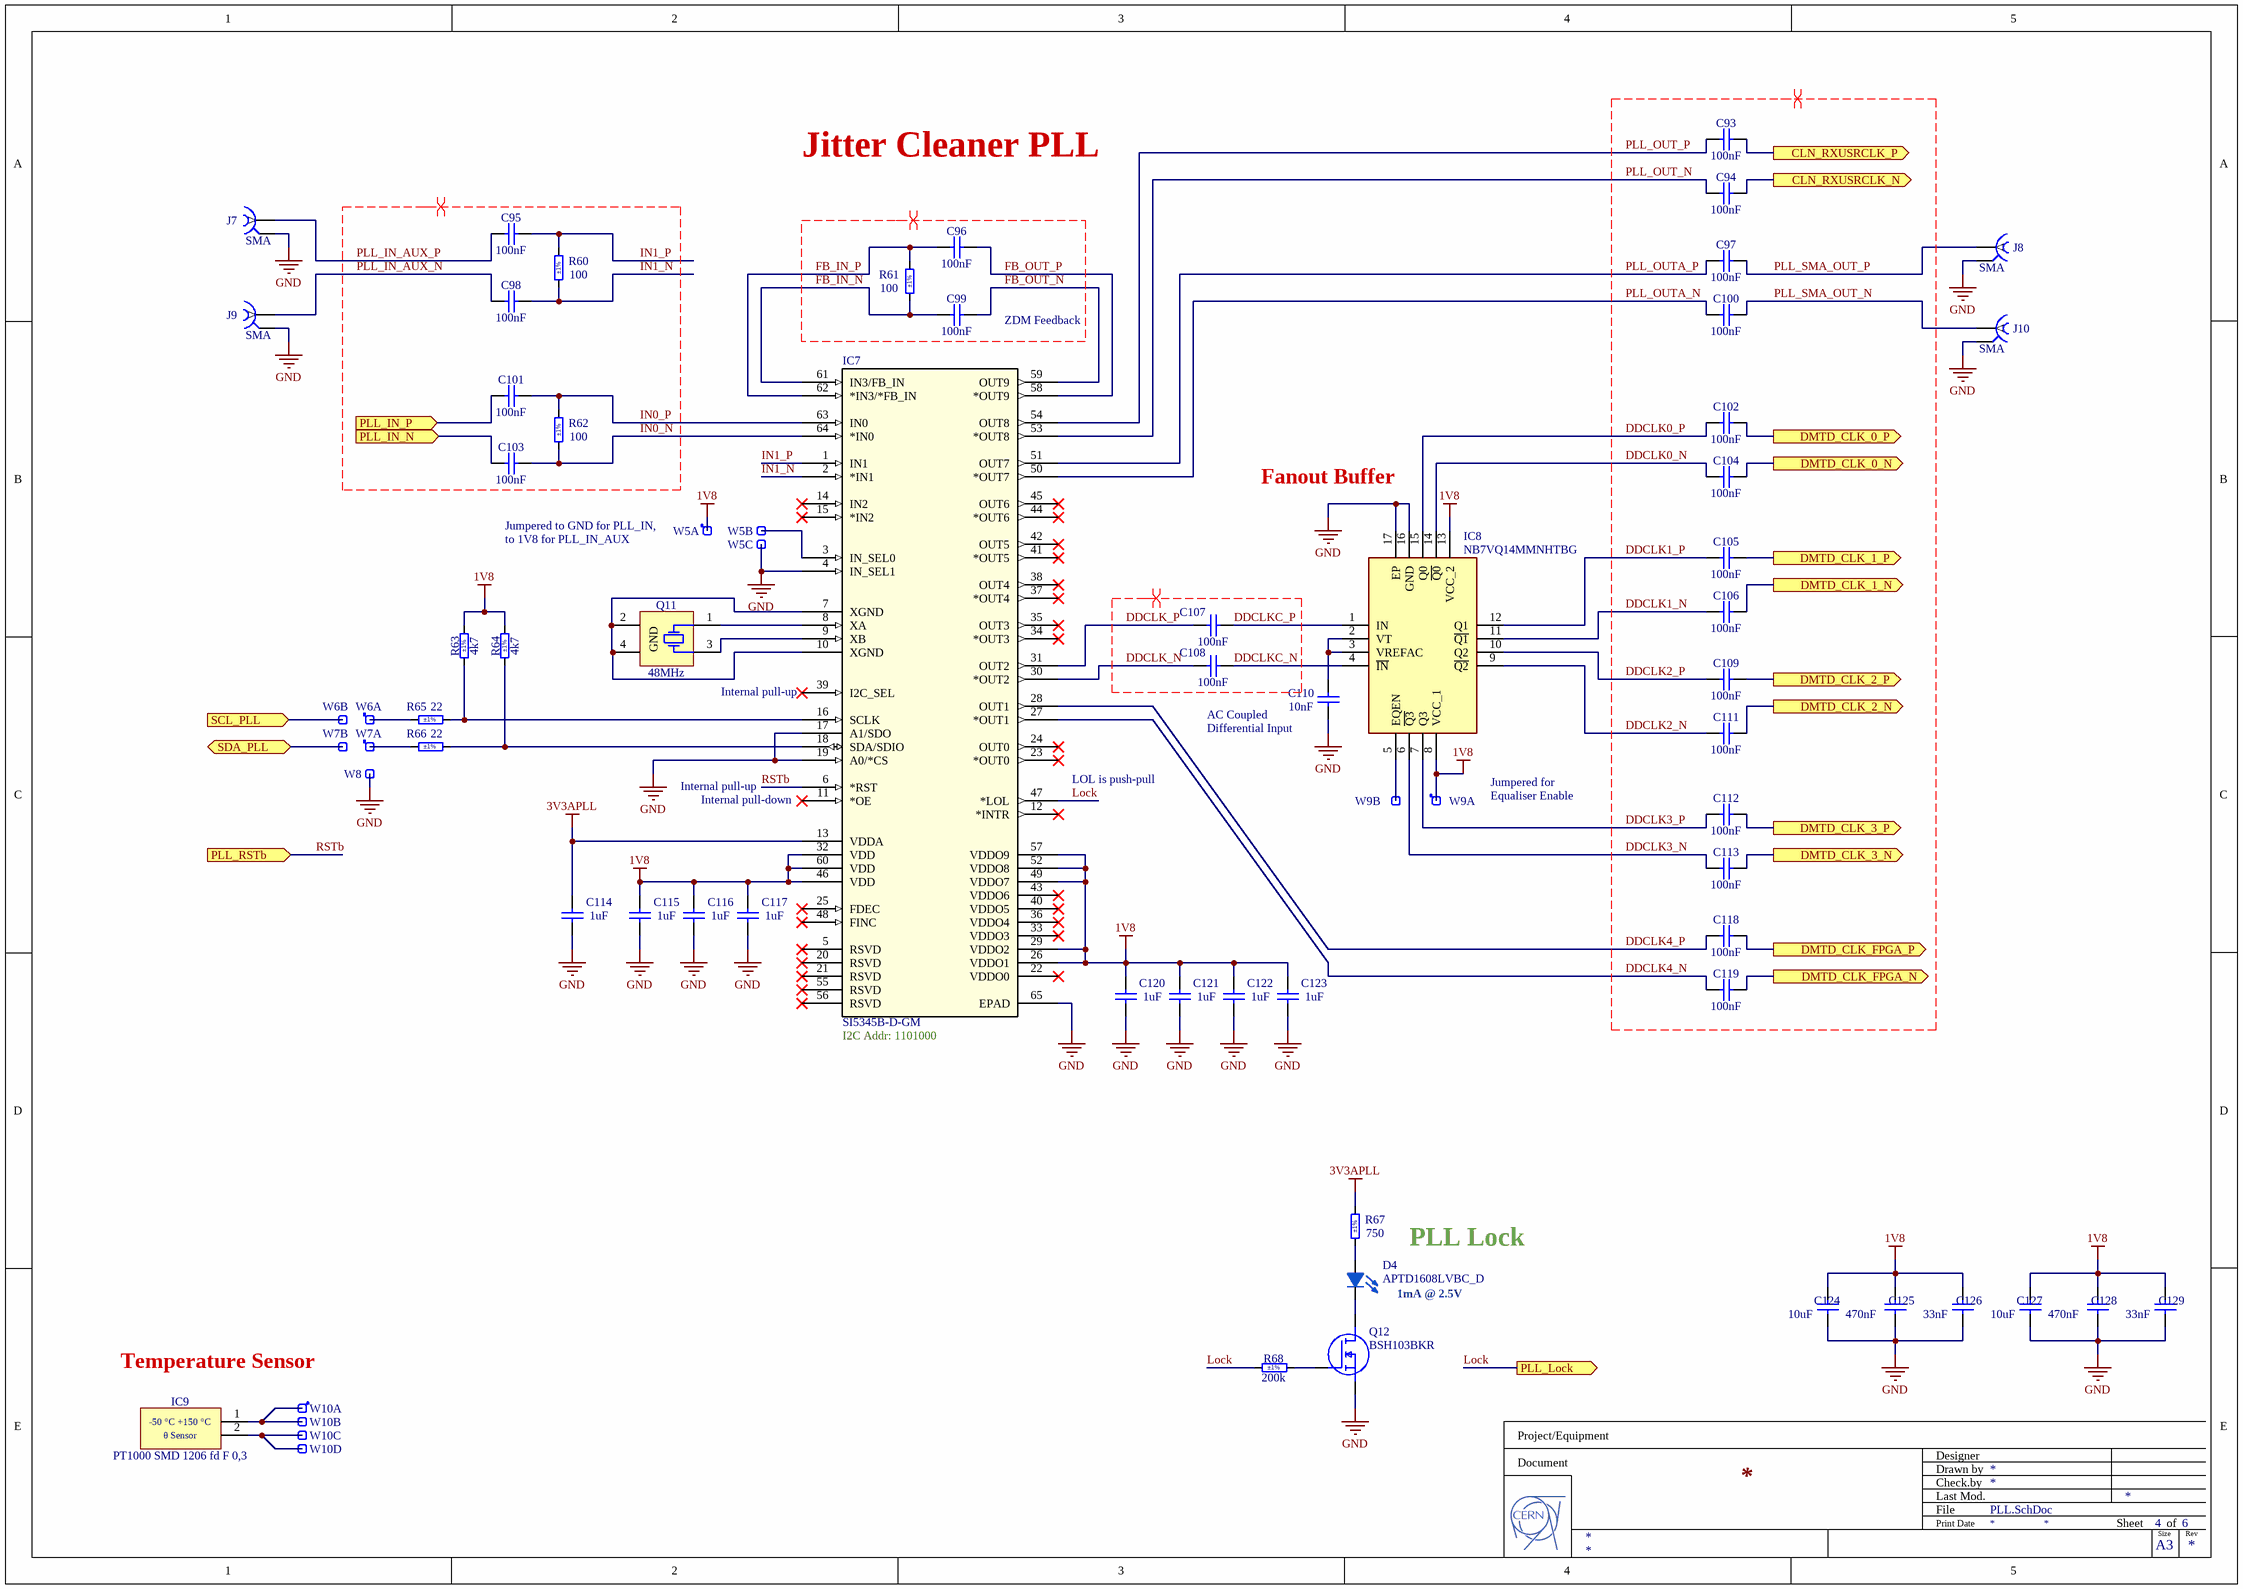
[diagram p2: PLL.SchDoc]

### Parts
C93  100nF  [CAPC0603X33N]
C94  100nF  [CAPC0603X33N]
C95  100nF  [CAPC0603X33N]
C96  100nF  [CAPC0603X33N]
C97  100nF  [CAPC0603X33N]
C98  100nF  [CAPC0603X33N]
C99  100nF  [CAPC0603X33N]
C100  100nF  [CAPC0603X33N]
C101  100nF  [CAPC0603X33N]
C102  100nF  [CAPC0603X33N]
C103  100nF  [CAPC0603X33N]
C104  100nF  [CAPC0603X33N]
C105  100nF  [CAPC0603X33N]
C106  100nF  [CAPC0603X33N]
C107  100nF  [CAPC0603X33N]
C108  100nF  [CAPC0603X33N]
C109  100nF  [CAPC0603X33N]
C110  10nF  [CAPC0603X33N]
C111  100nF  [CAPC0603X33N]
C112  100nF  [CAPC0603X33N]
C113  100nF  [CAPC0603X33N]
C114  1uF  [CAPC1005X55N]
C115  1uF  [CAPC1005X55N]
C116  1uF  [CAPC1005X55N]
C117  1uF  [CAPC1005X55N]
C118  100nF  [CAPC0603X33N]
C119  100nF  [CAPC0603X33N]
C120  1uF  [CAPC1005X55N]
C121  1uF  [CAPC1005X55N]
C122  1uF  [CAPC1005X55N]
C123  1uF  [CAPC1005X55N]
C124  10uF  [CAPC1608X87N]
C125  470nF  [CAPC0510X04N]
C126  33nF  [LLL03TR61E333KE01]
C127  10uF  [CAPC1608X87N]
C128  470nF  [CAPC0510X04N]
C129  33nF  [LLL03TR61E333KE01]
D4  APTD1608LVBC_D  [LEDC1608X110N]
IC7  SI5345B-D-GM  [QFN50P900X900X90-65N-D]
IC8  NB7VQ14MMNHTBG  [QFN50P300X300X100-17N]
IC9  PT1000 SMD 1206 fd F 0,3  [DFN310X150X55-2N]
J7  SMA  [SAMTEC_SMA-J-P-H-ST-MT1]
J8  SMA  [SAMTEC_SMA-J-P-H-ST-MT1]
J9  SMA  [SAMTEC_SMA-J-P-H-ST-MT1]
J10  SMA  [SAMTEC_SMA-J-P-H-ST-MT1]
Q11  48MHz  [XTAL_KYOCERA_CX3225SB]
Q12  BSH103BKR  [SOT95P230X110-3N]
R60  100  Tolerance: ±1%  [RESC0603X28N]
R61  100  Tolerance: ±1%  [RESC0603X28N]
R62  100  Tolerance: ±1%  [RESC0603X28N]
R63  4k7  Tolerance: ±1%  [RESC1005X40N]
R64  4k7  Tolerance: ±1%  [RESC1005X40N]
R65  22  Tolerance: ±1%  [RESC1005X40N]
R66  22  Tolerance: ±1%  [RESC1005X40N]
R67  750  Tolerance: ±1%  [RESC1005X40N]
R68  200k  Tolerance: ±1%  [RESC1005X40N]
W5  Header 3  [SAMTEC_HTSW-103-23-L-S]  (value not drawn)  (parts A,B,C of 3)
W6  Header 2  [SAMTEC_HTSW-102-23-L-S]  (value not drawn)  (parts A,B of 2)
W7  Header 2  [SAMTEC_HTSW-102-23-L-S]  (value not drawn)  (parts A,B of 2)
W8  Header 1  [SAMTEC_HTSW-101-23-L-S]  (value not drawn)
W9  Header 2  [SAMTEC_HTSW-102-23-L-S]  (value not drawn)  (parts A,B of 2)
W10  Header 4  [SAMTEC_HTSW-104-23-L-S]  (value not drawn)  (parts A,B,C,D of 4)

### Ports
CLN_RXUSRCLK_N (out), CLN_RXUSRCLK_P (out), DMTD_CLK_0_N (out), DMTD_CLK_0_P (out), DMTD_CLK_1_N (out), DMTD_CLK_1_P (out), DMTD_CLK_2_N (out), DMTD_CLK_2_P (out), DMTD_CLK_3_N (out), DMTD_CLK_3_P (out), DMTD_CLK_FPGA_N (out), DMTD_CLK_FPGA_P (out), PLL_IN_N (in), PLL_IN_P (in), PLL_Lock (out), PLL_RSTb (in), SCL_PLL (in), SDA_PLL (bidir)

### Nets
1V8: C115.2 C116.2 C117.2 C120.2 C121.2 C122.2 C123.2 C124.2 C125.2 C126.2 C127.2 C128.2 C129.2 IC7.26(VDDO1) IC7.29(VDDO2) IC7.32(VDD) IC7.46(VDD) IC7.49(VDDO7) IC7.52(VDDO8) IC7.57(VDDO9) IC7.60(VDD) IC8.8(VCC_1) IC8.13(VCC_2) R63.2 R64.2 W5.1 W9.1
3V3APLL: C114.2 IC7.13(VDDA) R67.2
GND: C110.1 C114.1 C115.1 C116.1 C117.1 C120.1 C121.1 C122.1 C123.1 C124.1 C125.1 C126.1 C127.1 C128.1 C129.1 IC7.4(IN_SEL1) IC7.17(A1/SDO) IC7.19(A0/*CS) IC7.65(EPAD) IC8.16(GND) IC8.17(EP) J7.2 J8.2 J9.2 J10.2 Q12.2(S) W5.3 W8.1
ADJ_SCL: W6.2 ; port SCL_PLL
ADJ_SDA: W7.2 ; port SDA_PLL
CLN_RXUSRCLK_N: C94.2 ; port CLN_RXUSRCLK_N
CLN_RXUSRCLK_P: C93.2 ; port CLN_RXUSRCLK_P
DDCLK0_N: C104.1 IC8.14(~{Q0})
DDCLK0_P: C102.1 IC8.15(Q0)
DDCLK1_N: C106.1 IC8.11(~{Q1})
DDCLK1_P: C105.1 IC8.12(Q1)
DDCLK2_N: C111.1 IC8.9(~{Q2})
DDCLK2_P: C109.1 IC8.10(Q2)
DDCLK3_N: C113.1 IC8.6(~{Q3})
DDCLK3_P: C112.1 IC8.7(Q3)
DDCLK4_N: C119.1 IC7.27(*OUT1)
DDCLK4_P: C118.1 IC7.28(OUT1)
DDCLK_N: C108.1 IC7.30(*OUT2)
DDCLK_P: C107.1 IC7.31(OUT2)
DDCLKC_N: C108.2 IC8.4(~{IN})
DDCLKC_P: C107.2 IC8.1(IN)
DMTD_CLK_0_N: C104.2 ; port DMTD_CLK_0_N
DMTD_CLK_0_P: C102.2 ; port DMTD_CLK_0_P
DMTD_CLK_1_N: C106.2 ; port DMTD_CLK_1_N
DMTD_CLK_1_P: C105.2 ; port DMTD_CLK_1_P
DMTD_CLK_2_N: C111.2 ; port DMTD_CLK_2_N
DMTD_CLK_2_P: C109.2 ; port DMTD_CLK_2_P
DMTD_CLK_3_N: C113.2 ; port DMTD_CLK_3_N
DMTD_CLK_3_P: C112.2 ; port DMTD_CLK_3_P
DMTD_CLK_FPGA_N: C119.2 ; port DMTD_CLK_FPGA_N
DMTD_CLK_FPGA_P: C118.2 ; port DMTD_CLK_FPGA_P
FB_IN_N: C99.1 IC7.61(IN3/FB_IN) R61.1
FB_IN_P: C96.1 IC7.62(*IN3/*FB_IN) R61.2
FB_OUT_N: C99.2 IC7.59(OUT9)
FB_OUT_P: C96.2 IC7.58(*OUT9)
IN0_N: C103.1 IC7.64(*IN0) R62.1
IN0_P: C101.1 IC7.63(IN0) R62.2
IN1_N: C98.1 IC7.2(*IN1) R60.1
IN1_P: C95.1 IC7.1(IN1) R60.2
Lock: IC7.47(*LOL) R68.1 ; port PLL_Lock
PLL_IN_AUX_N: C98.2 J9.1
PLL_IN_AUX_P: C95.2 J7.1
PLL_OUT_N: C94.1 IC7.53(*OUT8)
PLL_OUT_P: C93.1 IC7.54(OUT8)
PLL_OUTA_N: C100.1 IC7.50(*OUT7)
PLL_OUTA_P: C97.1 IC7.51(OUT7)
PLL_SMA_OUT_N: C100.2 J10.1
PLL_SMA_OUT_P: C97.2 J8.1
RSTb: IC7.6(*RST) ; port PLL_RSTb  [project net PLL_RSTb]
RXUSRCLK_N: C103.2 ; port PLL_IN_N
RXUSRCLK_P: C101.2 ; port PLL_IN_P
NetC110_2: C110.2 IC8.2(VT) IC8.3(VREFAC)
NetD4_1: D4.1(C) Q12.3(D)
NetD4_2: D4.2(A) R67.1
NetIC7_3: IC7.3(IN_SEL0) W5.2
NetIC7_7: IC7.7(XGND) IC7.10(XGND) Q11.2(GND) Q11.4(GND)
NetIC7_8: IC7.8(XA) Q11.1(X)
NetIC7_9: IC7.9(XB) Q11.3(X)
NetIC7_16: IC7.16(SCLK) R63.1 R65.2
NetIC7_18: IC7.18(SDA/SDIO) R64.1 R66.2
NetIC8_5: IC8.5(EQEN) W9.2
NetIC9_1: IC9.1 W10.1 W10.2
NetIC9_2: IC9.2 W10.3 W10.4
NetQ12_1: Q12.1(G) R68.2
NetR65_1: R65.1 W6.1
NetR66_1: R66.1 W7.1

Not connected (* = marked no-connect by the designer): IC7 5(RSVD)* 11(*OE)* 12(*INTR)* 14(IN2)* 15(*IN2)* 20(RSVD)* 21(RSVD)* 22(VDDO0)* 23(*OUT0)* 24(OUT0)* 25(FDEC)* 33(VDDO3)* 34(*OUT3)* 35(OUT3)* 36(VDDO4)* 37(*OUT4)* 38(OUT4)* 39(I2C_SEL)* 40(VDDO5)* 41(*OUT5)* 42(OUT5)* 43(VDDO6)* 44(*OUT6)* 45(OUT6)* 48(FINC)* 55(RSVD)* 56(RSVD)*

### Layout directives
differential pair: DDCLK0_N, DDCLK0_P, DDCLK1_N, DDCLK1_P, DDCLK2_N, DDCLK2_P, DDCLK3_N, DDCLK3_P, DDCLK4_N, DDCLK4_P, DDCLK_N, DDCLK_P, DDCLKC_N, DDCLKC_P, FB_IN_N, FB_IN_P, FB_OUT_N, FB_OUT_P, IN0_N, IN0_P, IN1_N, IN1_P, PLL_IN_AUX_N, PLL_IN_AUX_P, PLL_OUT_N, PLL_OUT_P, PLL_OUTA_N, PLL_OUTA_P, PLL_SMA_OUT_N, PLL_SMA_OUT_P

### Notes on the sheet
- Jitter Cleaner PLL
- ZDM Feedback
- Fanout Buffer
- Jumpered to GND for PLL_IN, to 1V8 for PLL_IN_AUX
- (near IC7) Internal pull-up
- AC Coupled
  Differential Input
- Internal pull-up
- (near IC7) Internal pull-down
- LOL is push-pull
- Jumpered for Equaliser Enable
- (near IC7) I2C Addr: 1101000
- PLL Lock
- 1mA @ 2.5V
- Temperature Sensor
- Project/Equipment
- Document
- Designer
- Drawn by
- Check.by
- File
- Last Mod.
- Print Date
- Sheet
- Size
- A3
- of
- Rev
- (in symbol PT1000 SMD 1206 fd F 0,3) -50 °C +150 °C; θ Sensor

### Library data of the parts
C93-C109 C111-C113 C118 C119 = CC0201_100NF_6.3V_10%_X7R: as C69 on sheet SFP; Part Number: CC0201_100NF_6.3V_10%_X7R; Component Kind: Standard; Component Type: Standard; Pin Count: 2; Value: 100nF; Status: Not Recommended; Manufacturer Part Number: CC0201_100NF_6.3V_10%_X7R; Case: 0201; Mounted: Yes; Socket: No; SMD: Yes; Sense: No; Manufacturer1 Example: YAGEO PHYCOMP; Manufacturer1 ComponentHeight: 0.33mm; HelpURL: \\cern.ch\dfs\Applications\Altium\Datasheets\CC0201_X7R_YAGEO_6.3VTO50V.pdf; Author: CERN DEM BC; CreateDate: 11/20/2020; LatestRevisionDate: 11/20/2020
C110 = CC0201_10NF_10V_10%_X5R: Non-polarised capacitor; Part Description: SMD Multilayer Chip Ceramic Capacitor; Manufacturer: GENERIC; Manufacturer1 Part Number: 0201ZD103KAT2A; Voltage: 10V; TC: X5R; Tolerance: ±10%; Part Number: CC0201_10NF_10V_10%_X5R; Component Kind: Standard; Component Type: Standard; Pin Count: 2; Value: 10nF; Status: Not Recommended; Manufacturer Part Number: CC0201_10NF_10V_10%_X5R; Case: 0201; Mounted: Yes; Socket: No; SMD: Yes; Sense: No; Manufacturer1 Example: AVX; Manufacturer1 ComponentHeight: 0.33mm; HelpURL: \\cern.ch\dfs\Applications\Altium\Datasheets\CC0201_X5R_AVX.pdf; Author: CERN DEM JLC; CreateDate: 12/3/2007; LatestRevisionDate: 12/3/2007
C114-C117 C120-C123 = CC0402_1UF_16V_10%_X5R: GRM153B30J105ME15; Part Description: SMD Multilayer Chip Ceramic Capacitor; Manufacturer: GENERIC; Manufacturer1 Part Number: C1005X5R1C105KT; Voltage: 16V; TC: X5R; Tolerance: ±10%; Part Number: CC0402_1UF_16V_10%_X5R; Component Kind: Standard; Component Type: Standard; Pin Count: 2; Value: 1uF; Status: Preferred; Manufacturer Part Number: CC0402_1UF_16V_10%_X5R; Case: 0402; Mounted: Yes; Socket: No; SMD: Yes; Sense: No; Manufacturer1 Example: TDK; Manufacturer1 ComponentHeight: 0.55mm; HelpURL: \\cern.ch\dfs\Applications\Altium\Datasheets\CC0402_X5R_TDK_C.pdf; Author: CERN DEM JLC; CreateDate: 10/25/2012; LatestRevisionDate: 10/25/2012
C124 C127 = CC0603_10UF_6.3V_20%_X5R: GRM188D71A106KA73; Part Description: SMD Multilayer Chip Ceramic Capacitor; Manufacturer: GENERIC; Manufacturer1 Part Number: C0603C106M9PAC; Voltage: 6.3V; TC: X5R; Tolerance: ±20%; Part Number: CC0603_10UF_6.3V_20%_X5R; Component Kind: Standard; Component Type: Standard; Pin Count: 2; Value: 10uF; Status: Preferred; Manufacturer Part Number: CC0603_10uF_6.3V_20%_X5R; Case: 0603; Mounted: Yes; Socket: No; SMD: Yes; Sense: No; Manufacturer1 Example: KEMET; Manufacturer1 ComponentHeight: 0.95mm; HelpURL: \\cern.ch\dfs\Applications\Altium\Datasheets\CC0603_X5R_KEMET.pdf; Author: CERN DEM JLC; CreateDate: 03/12/2007; LatestRevisionDate: 03/12/2007
C125 C128 = Capacitor - non polarized: LLL153C70G474ME17; Value: 470nF
C126 C129 = Capacitor - non polarized: LLL03TR61E333KE01; Value: 33nF
D4 = APTD1608LVBC_D: Led Blue 0603 2mA 2.65V 65mcd 120mW; Manufacturer_Name: Kingbright; Manufacturer_Part_Number: APTD1608LVBC/D; Geometry.Height: 1.1mm; Mouser Part Number: 604-APTD1608LVBCD; Mouser Price/Stock: https://www.mouser.co.uk/ProductDetail/Kingbright/APTD1608LVBC-D?qs=6oMev5NRZMEfNSg5xIhlKA%3D%3D; Datasheet Link: https://componentsearchengine.com/Datasheets/1/APTD1608LVBC_D.pdf
IC7 = SI5345B-D-GM: Integrated Circuit; Manufacturer_Name: Skyworks; Datasheet Link: https://www.mouser.sg/datasheet/2/472/si5345_44_42_d_datasheet-2507675.pdf; Height: 0.9mm; Manufacturer_Part_Number: SI5345B-D-GM; Mouser Part Number: 634-SI5345B-D-GM; Mouser Price/Stock: https://www.mouser.co.uk/ProductDetail/Skyworks-Solutions-Inc/SI5345B-D-GM?qs=p9T7GgSe1IGHqFUKlxUKrA%3D%3D
IC8 = NB7VQ14MMNHTBG: Integrated Circuit; Manufacturer_Name: onsemi; Datasheet Link: http://www.onsemi.com/pub/Collateral/NB7VQ14M-D.PDF; Height: 1mm; Manufacturer_Part_Number: NB7VQ14MMNHTBG; Mouser Part Number: 863-NB7VQ14MMNHTBG; Mouser Price/Stock: https://www.mouser.co.uk/ProductDetail/onsemi/NB7VQ14MMNHTBG?qs=3PKVEWFFm2%2FWq%2FFZ4xstfg%3D%3D; Arrow Part Number: NB7VQ14MMNHTBG; Arrow Price/Stock: https://www.arrow.com/en/products/nb7vq14mmnhtbg/on-semiconductor?utm_currency=USD&region=nac
IC9 = PT1000 SMD 1206 fd F 0,3: 2 Pin Temperature Sensor; Part Description: -50°C to +150°C, 1000 Ohm at 0°C Platinum Temperature Sensor; Manufacturer: UMWELTSENSORTECHNIK GmbH (UST); PressFit: No; Bonding: No; Part Number: PT1000 SMD 1206 fd F 0,3; Component Kind: Standard; Component Type: Standard; Device: PT1000 SMD 1206 fd F 0,3; PackageDescription: DFN; 2 Pin,3.10mm L X 1.50mm W X 0.40mm H, IPC Medium Density; Manufacturer Part Number: PT1000 SMD 1206 fd F 0,3; Pin Count: 2; Case: DFN2; Mounted: Yes; Socket: No; SMD: Yes; Sense: No; ComponentHeight: 0.55mm; HelpURL: \\cern.ch\dfs\Applications\Altium\Datasheets\PT1000 SMD 1206 fd.pdf; Author: CERN DEM JLC; CreateDate: 8/20/2018; LatestRevisionDate: 8/22/2018
J7-J10 = SAMTEC_SMA-J-P-H-ST-MT1: Part Description: 50 Ohms SMA Straight Mixed Technology PCB Jack; Manufacturer: SAMTEC; PressFit: No; Sense Comment: assembly limitations; Part Number: SAMTEC_SMA-J-P-H-ST-MT1; Component Kind: Standard; Component Type: Standard; Pin Count: 5; Family: SMA; Mounted: Yes; Socket: No; SMD: Yes; Sense: Yes; Status: Not Recommended; Manufacturer Part Number: SMA-J-P-H-ST-MT1; ComponentHeight: 7.95mm; HelpURL: \\cern.ch\dfs\Applications\Altium\Datasheets\SAMTEC_SMA-J-P-H-ST-MT1.pdf; Author: CERN DEM HF; CreateDate: 5/24/2023; LatestRevisionDate: 5/24/2023
Q11 = XTAL_48MHZ_KYOCERA_CX3225SB48000D0FPJC1: Crystal 4 pins 1=XTAL Control 2=GND3=XTAL 4=GND; Part Description: Tolerance: ±10ppm, Stability: ±15ppm, 8pF, -40°C to +85°C, Surface Mount Crystal; PressFit: No; Bonding: No; Part Number: XTAL_48MHZ_KYOCERA_CX3225SB48000D0FPJC1; Component Kind: Standard; Component Type: Standard; PackageDescription: SMD Crystal Kyocera, 4 Pins, 2.50mm L X 3.20mm W X 0.6mm H; Value: 48MHz; Manufacturer: KYOCERA; Manufacturer Part Number: CX3225SB48000D0FPJC1; Pin Count: 4; Mounted: Yes; Socket: No; SMD: Yes; Sense: No; ComponentHeight: 0.6mm; HelpURL: \\cern.ch\dfs\Applications\Altium\Datasheets\XTAL_KYOCERA_CX3225SB.pdf; Author: CERN DEM JLC; CreateDate: 6/5/2018; LatestRevisionDate: 6/5/2018
Q12 = BSH103BKR: as Q7 on sheet SFP; Datasheet Link: https://ms.componentsearchengine.com/Datasheets/2/BSH103BKR.pdf; Height: 1.1mm; Manufacturer_Part_Number: BSH103BKR; Mouser Part Number: 771-BSH103BKR; Mouser Price/Stock: https://www.mouser.co.uk/ProductDetail/Nexperia/BSH103BKR?qs=GCAb4wyKXLKD%2FWt2ta8c7Q%3D%3D; Arrow Part Number: BSH103BKR; Arrow Price/Stock: https://www.arrow.com/en/products/bsh103bkr/nexperia?region=europe
R60-R62 = R0201_100R_1%_0.05W_200PPM: Resistor - 1%; Part Description: Thick Film Chip Resistor; Manufacturer: GENERIC; Manufacturer1 Part Number: CRCW0201100RFNED; Power: 0.05W; TC: ±200ppm/°C; PressFit: No; Part Number: R0201_100R_1%_0.05W_200PPM; Component Kind: Standard; Component Type: Standard; Pin Count: 2; Value: 100; Status: Not Recommended; Manufacturer Part Number: R0201_100R_1%_0.05W_200PPM; Case: 0201; Mounted: Yes; Sense: No; Socket: No; SMD: Yes; Manufacturer1 Example: VISHAY; Manufacturer1 ComponentHeight: 0.27mm; HelpURL: \\cern.ch\dfs\Applications\Altium\Datasheets\R0201_VISHAY_CRCW e3.pdf; Author: CERN DEM JLC; CreateDate: 11/13/2014; LatestRevisionDate: 11/13/2014
R63 R64 = R0402_4K7_1%_0.0625W_100PPM: as R36 on sheet SFP; Part Number: R0402_4K7_1%_0.0625W_100PPM; Component Kind: Standard; Component Type: Standard; Pin Count: 2; Value: 4k7; Status: Not Recommended; Power: 0.0625W; Manufacturer Part Number: R0402_4K7_1%_0.0625W_100PPM; Case: 0402; Mounted: Yes; Sense: No; Socket: No; SMD: Yes; Manufacturer1 Example: YAGEO PHYCOMP; Manufacturer1 ComponentHeight: 0.4mm; HelpURL: \\cern.ch\dfs\Applications\Altium\Datasheets\R0402_Phycomp_RC0402.pdf; Author: CERN DEM JLC; CreateDate: 12/3/2007; LatestRevisionDate: 10/17/2012
R65 R66 = R0402_22R_1%_0.0625W_100PPM: Resistor - 1%; Part Description: General Purpose Thick Film Chip Resistor; Manufacturer: GENERIC; Manufacturer1 Part Number: 232270672209L; TC: ±100ppm/°C; PressFit: No; Part Number: R0402_22R_1%_0.0625W_100PPM; Component Kind: Standard; Component Type: Standard; Pin Count: 2; Value: 22; Status: Not Recommended; Power: 0.0625W; Manufacturer Part Number: R0402_22R_1%_0.0625W_100PPM; Case: 0402; Mounted: Yes; Sense: No; Socket: No; SMD: Yes; Manufacturer1 Example: YAGEO PHYCOMP; Manufacturer1 ComponentHeight: 0.4mm; HelpURL: \\cern.ch\dfs\Applications\Altium\Datasheets\R0402_Phycomp_RC0402.pdf; Author: CERN DEM JLC; CreateDate: 12/3/2007; LatestRevisionDate: 10/17/2012
R67 = R0402_750R_1%_0.0625W_100PPM: Resistor - 1%; Part Description: General Purpose Thick Film Chip Resistor; Manufacturer: GENERIC; Manufacturer1 Part Number: 232270677501L; TC: ±100ppm/°C; PressFit: No; Part Number: R0402_750R_1%_0.0625W_100PPM; Component Kind: Standard; Component Type: Standard; Pin Count: 2; Value: 750; Status: Not Recommended; Power: 0.0625W; Manufacturer Part Number: R0402_750R_1%_0.0625W_100PPM; Case: 0402; Mounted: Yes; Sense: No; Socket: No; SMD: Yes; Manufacturer1 Example: YAGEO PHYCOMP; Manufacturer1 ComponentHeight: 0.4mm; HelpURL: \\cern.ch\dfs\Applications\Altium\Datasheets\R0402_Phycomp_RC0402.pdf; Author: CERN DEM JLC; CreateDate: 12/3/2007; LatestRevisionDate: 10/17/2012
R68 = R0402_200K_1%_0.0625W_100PPM: as R39 on sheet SFP; Part Number: R0402_200K_1%_0.0625W_100PPM; Component Kind: Standard; Component Type: Standard; Pin Count: 2; Value: 200k; Status: Not Recommended; Power: 0.0625W; Manufacturer Part Number: R0402_200K_1%_0.0625W_100PPM; Case: 0402; Mounted: Yes; Sense: No; Socket: No; SMD: Yes; Manufacturer1 Example: YAGEO PHYCOMP; Manufacturer1 ComponentHeight: 0.4mm; HelpURL: \\cern.ch\dfs\Applications\Altium\Datasheets\R0402_Phycomp_RC0402.pdf; Author: CERN DEM JLC; CreateDate: 12/3/2007; LatestRevisionDate: 10/17/2012
W5 = SAMTEC_HTSW-103-23-L-S: 3 Mini Wire-Wrap Contact Strip Header; Part Description: 3 Contacts, Pitch 2.54mm, Single Row Through Mount Straight Header (Post Lead 5.84mm, Tail Lead 2.92mm, Insulator 2.54mm); Manufacturer: SAMTEC; PressFit: No; Status Comment: High Temperature; Part Number: SAMTEC_HTSW-103-23-L-S; Component Kind: Standard; Component Type: Standard; Pin Count: 3; Family: Header 3; Mounted: Yes; Socket: No; SMD: No; Sense: No; Status: Preferred; Manufacturer Part Number: HTSW-103-23-L-S; ComponentHeight: 8.38mm; HelpURL: \\cern.ch\dfs\Applications\Altium\Datasheets\SAMTEC_HTSW-103-23-L-S.pdf; Author: CERN DEM JLC; CreateDate: 2/22/2018; LatestRevisionDate: 2/22/2018
W6 W7 W9 = SAMTEC_HTSW-102-23-L-S: as W2 on sheet SFP; Part Number: SAMTEC_HTSW-102-23-L-S; Component Kind: Standard; Component Type: Standard; Pin Count: 2; Family: Header 2; Mounted: Yes; Socket: No; SMD: No; Sense: No; Status: Preferred; Manufacturer Part Number: HTSW-102-23-L-S; ComponentHeight: 8.38mm; HelpURL: \\cern.ch\dfs\Applications\Altium\Datasheets\SAMTEC_HTSW-102-23-L-S.pdf; Author: CERN DEM JLC; CreateDate: 2/22/2018; LatestRevisionDate: 2/22/2018
W8 = SAMTEC_HTSW-101-23-L-S: Single Mini Wire-Wrap Contact; Part Description: Single Contact Through Mount Straight Header (Post Lead 5.84mm, Tail Lead 2.92mm, Insulator 2.54mm); Manufacturer: SAMTEC; PressFit: No; Status Comment: High Temperature; Part Number: SAMTEC_HTSW-101-23-L-S; Component Kind: Standard; Component Type: Standard; Pin Count: 1; Family: Header 1; Mounted: Yes; Socket: No; SMD: No; Sense: No; Status: Preferred; Manufacturer Part Number: HTSW-101-23-L-S; ComponentHeight: 8.38mm; HelpURL: \\cern.ch\dfs\Applications\Altium\Datasheets\SAMTEC_HTSW-101-23-L-S.pdf; Author: CERN DEM JLC; CreateDate: 2/22/2018; LatestRevisionDate: 2/22/2018
W10 = SAMTEC_HTSW-104-23-L-S: 4 Mini Wire-Wrap Contact Strip Header; Part Description: 4 Contacts, Pitch 2.54mm, Single Row  Through Mount Straight Header (Post Lead 5.84mm, Tail Lead 2.92mm, Insulator 2.54mm); Manufacturer: SAMTEC; PressFit: No; Status Comment: High Temperature; Part Number: SAMTEC_HTSW-104-23-L-S; Component Kind: Standard; Component Type: Standard; Pin Count: 4; Family: Header 4; Mounted: Yes; Socket: No; SMD: No; Sense: No; Status: Preferred; Manufacturer Part Number: HTSW-104-23-L-S; ComponentHeight: 8.38mm; HelpURL: \\cern.ch\dfs\Applications\Altium\Datasheets\SAMTEC_HTSW-104-23-L-S.pdf; Author: CERN DEM JLC; CreateDate: 2/22/2018; LatestRevisionDate: 2/22/2018